# EasyEDA schematic SCH_FMC-R2_MTOP_2026-02-22.json

## Sheets
1 MAIN: TITLE: MAIN - Devboard 1; REV: 1.0; Date: 2026-02-08; Sheet: 1/1; Drawn By: Lloyd Cargo; Company: UNR
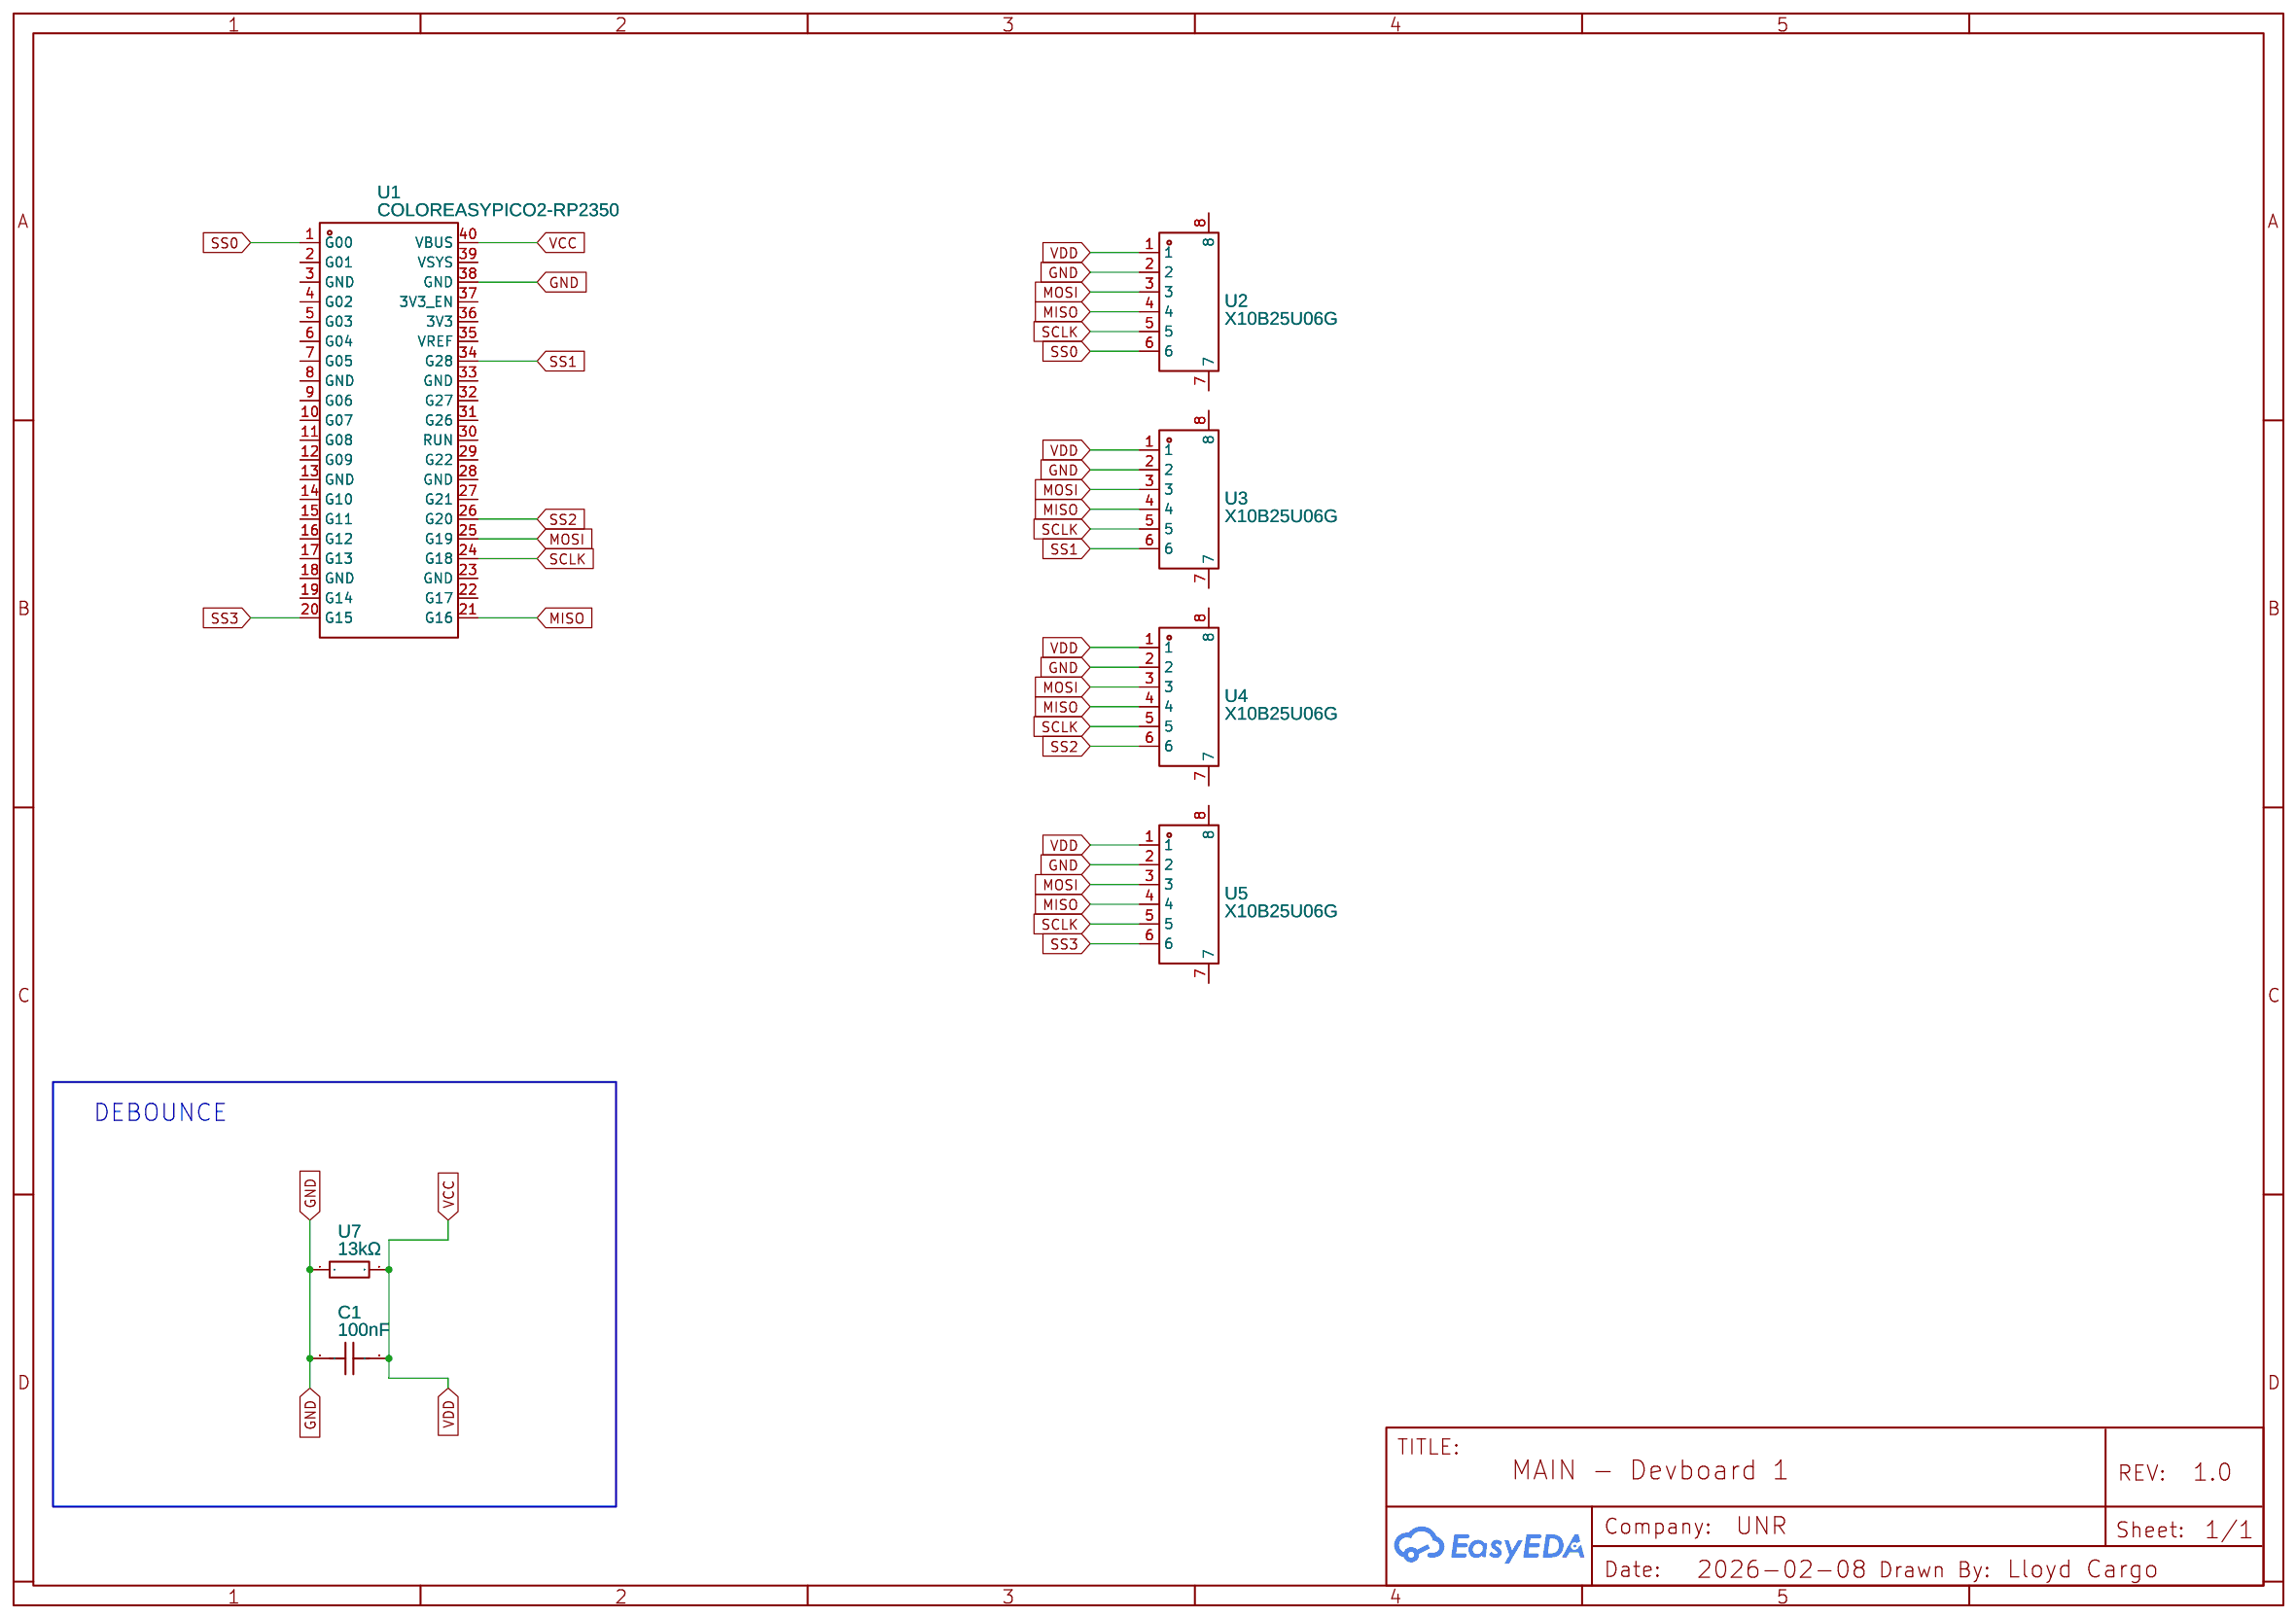
[diagram p0: MAIN]
2 module top: TITLE: module top
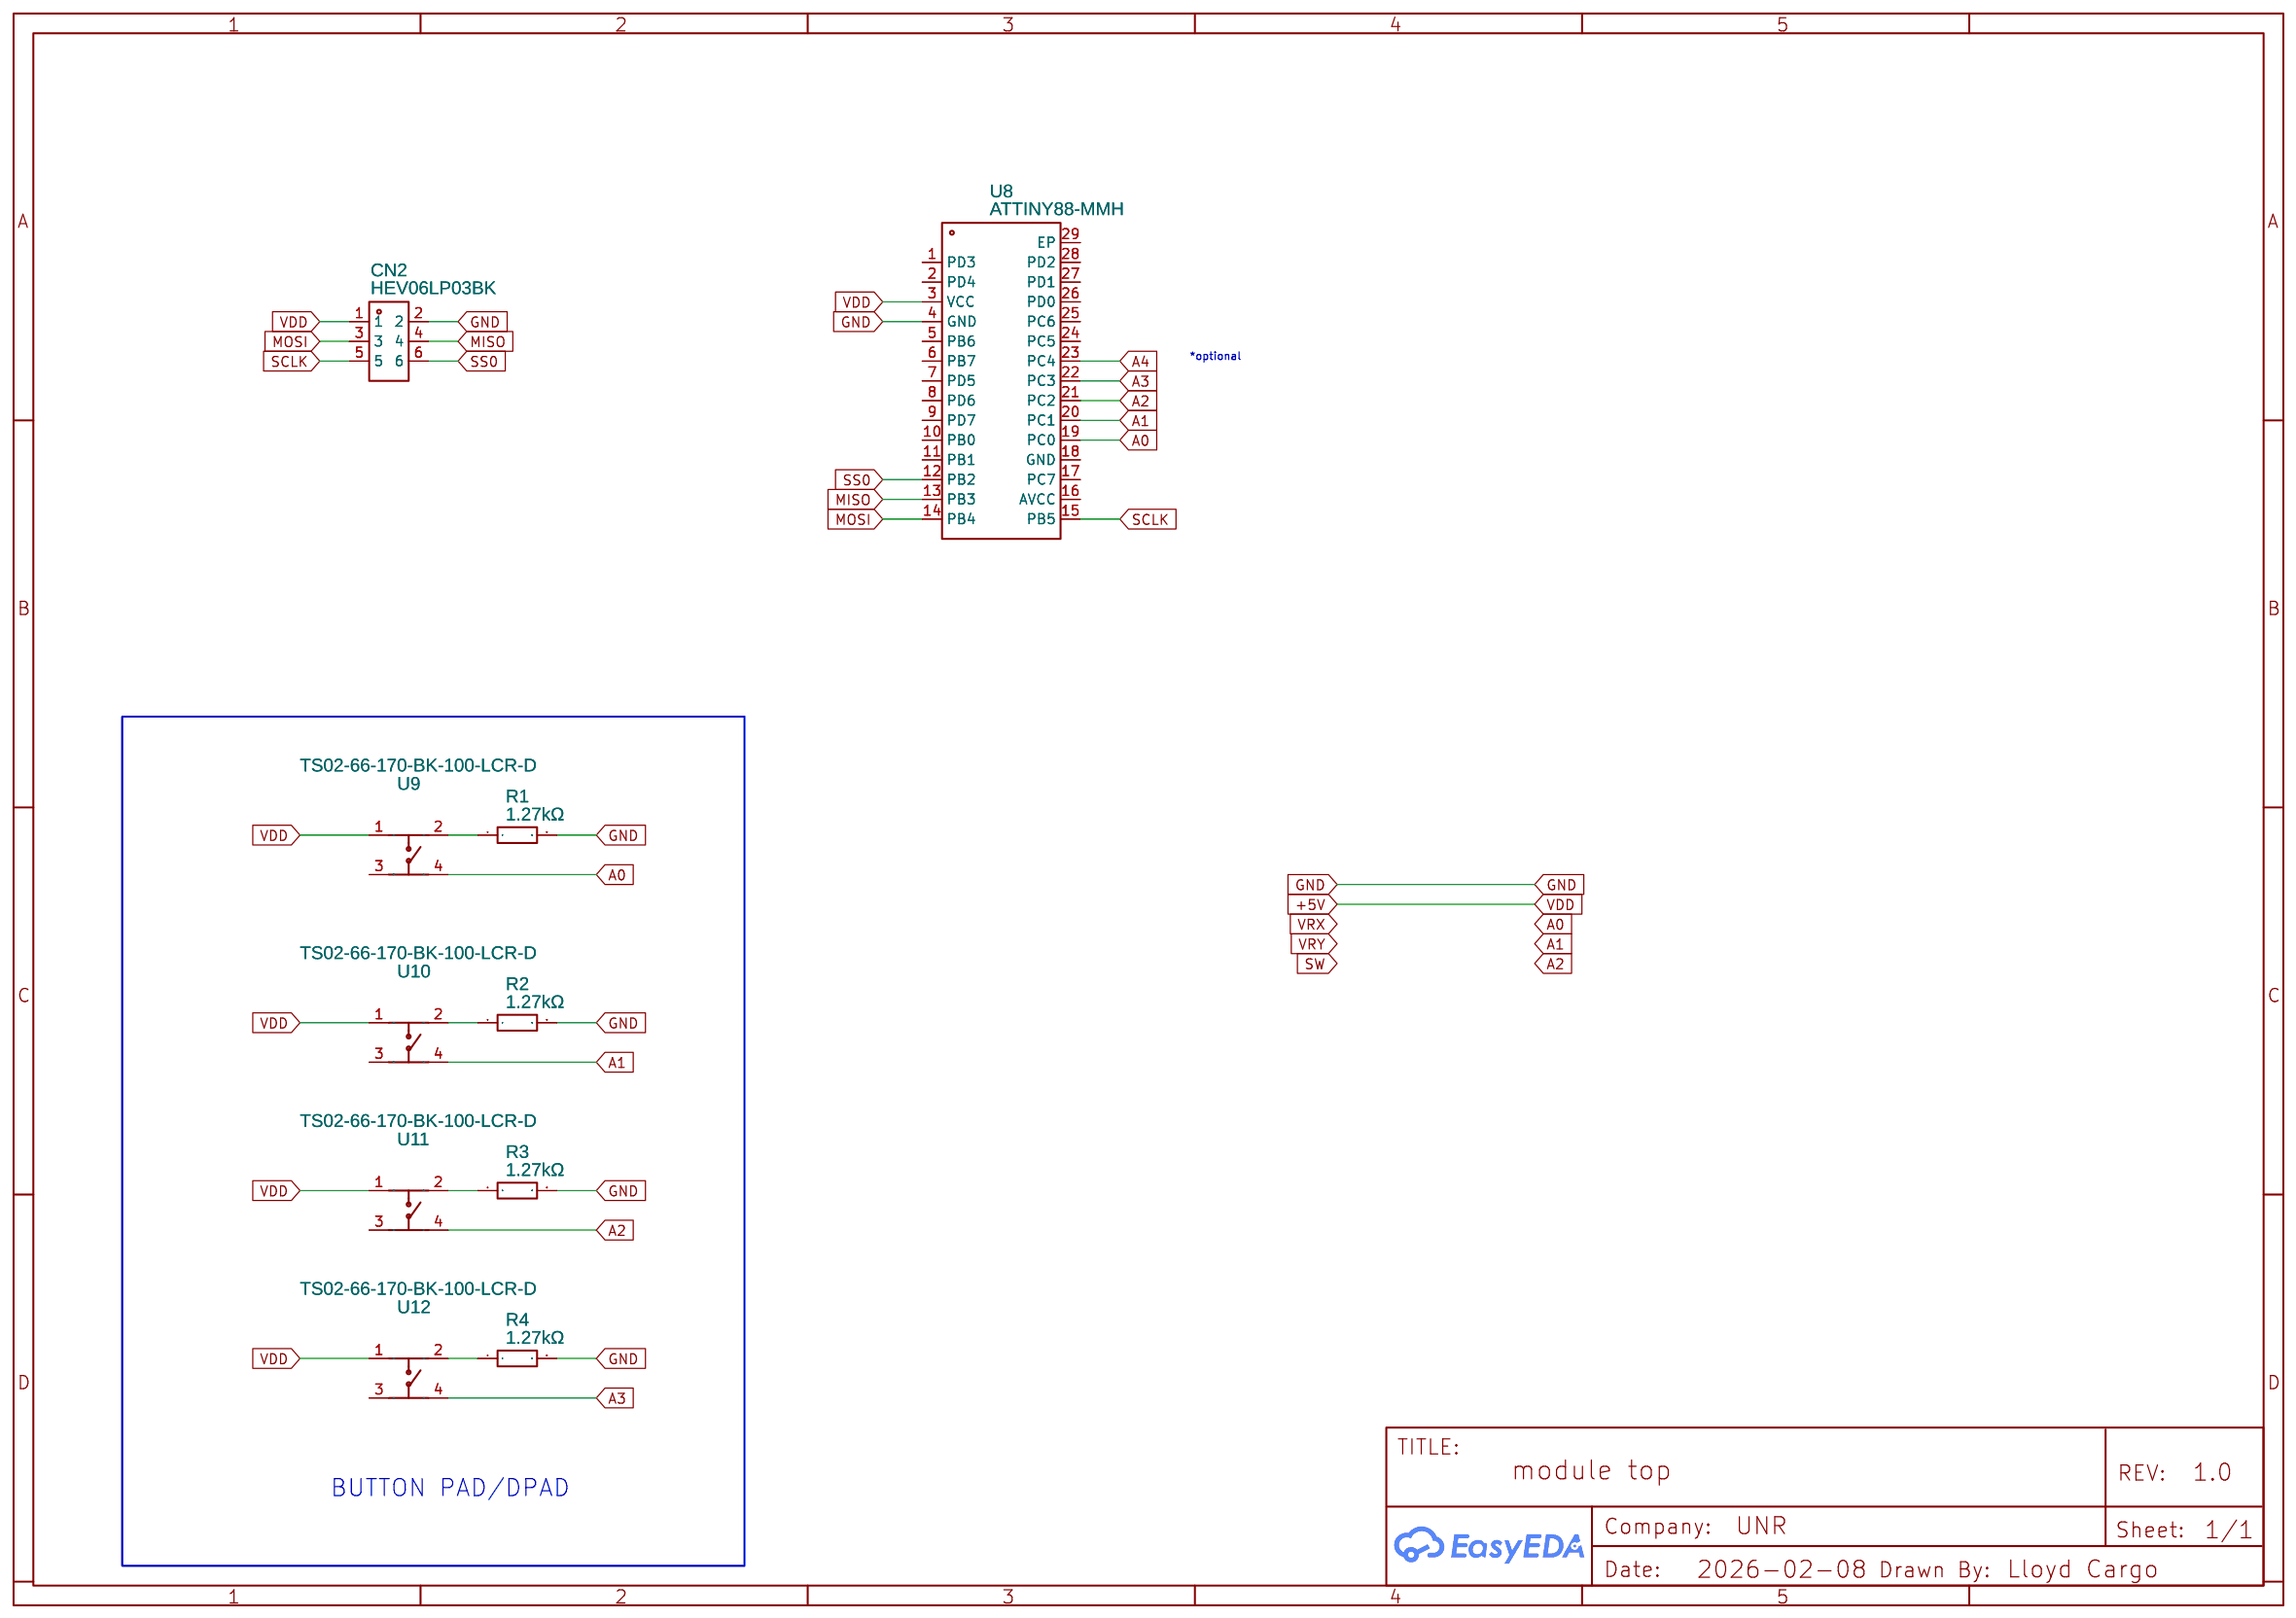
[diagram p1: module top]
3 module baseboard: TITLE: module baseboard; Company: Your Company
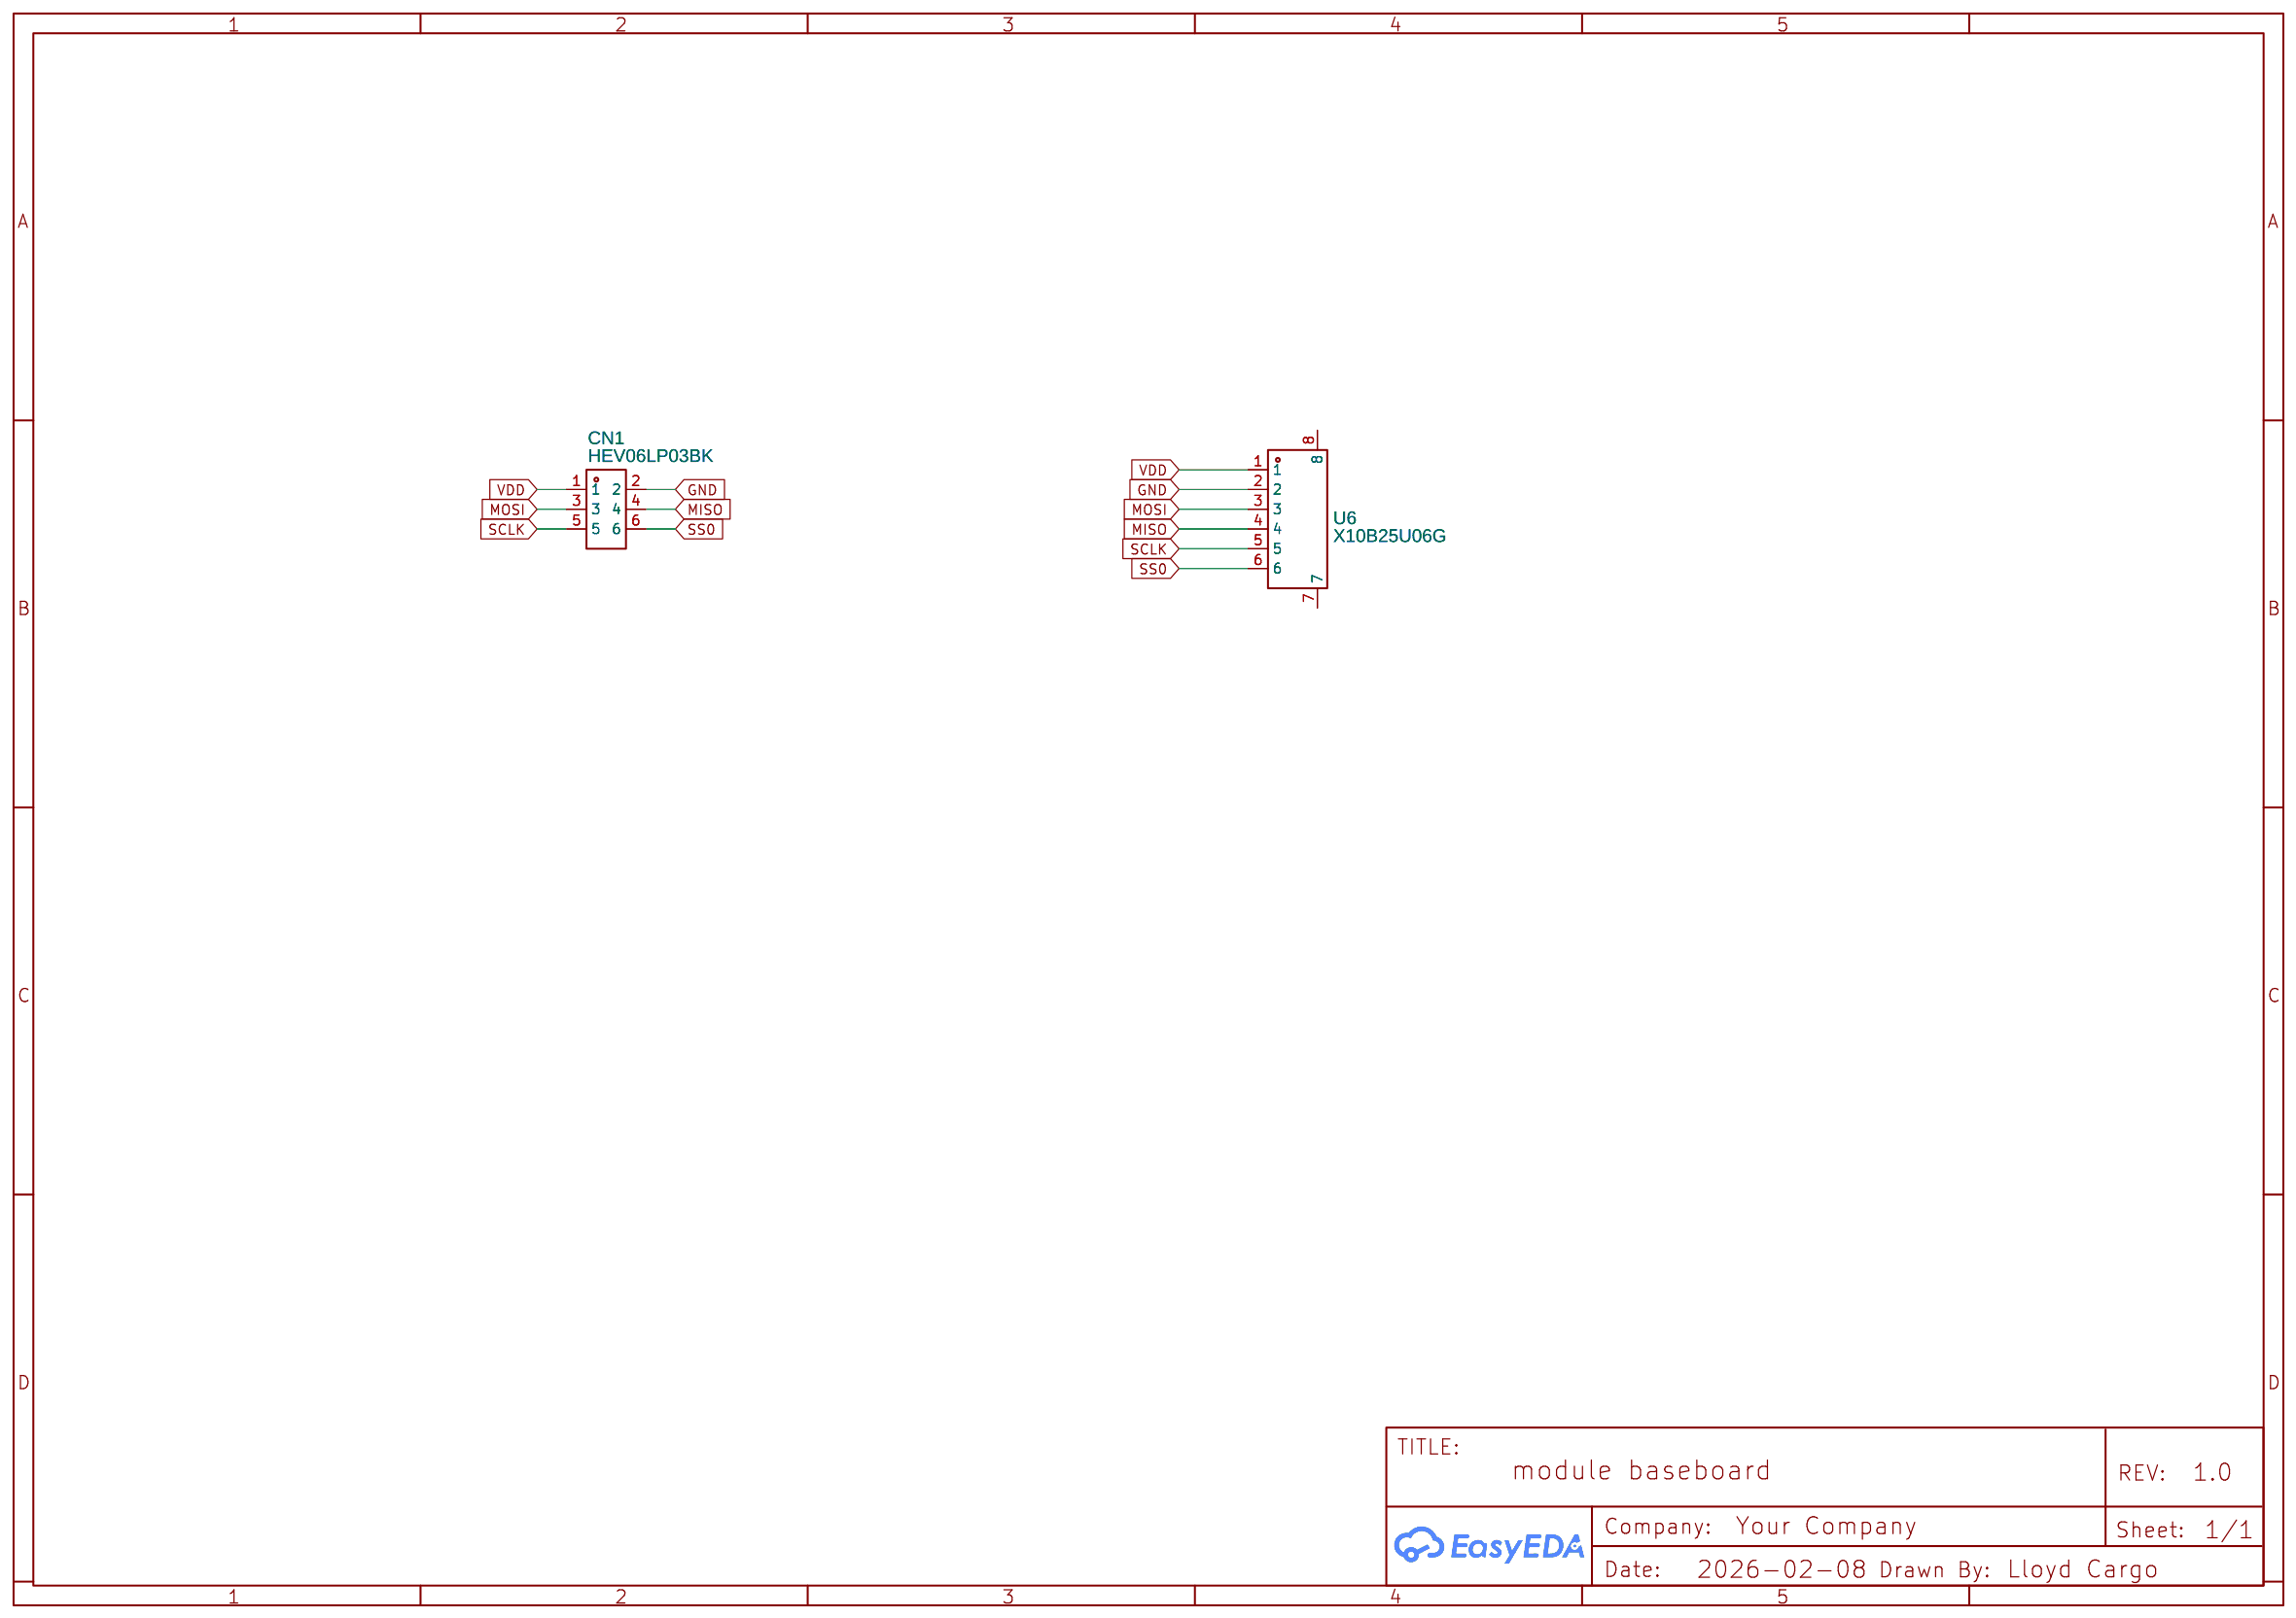
[diagram p2: module baseboard]

## Parts
sheet MAIN
C1  100nF  [C0603]
U1  COLOREASYPICO2-RP2350  [COMM-TH_COLOREASYPICO2-RP2350]
U2  X10B25U06G  [FPC-SMD_6P-P1.00_XKB_X10B25U06G]
U3  X10B25U06G  [FPC-SMD_6P-P1.00_XKB_X10B25U06G]
U4  X10B25U06G  [FPC-SMD_6P-P1.00_XKB_X10B25U06G]
U5  X10B25U06G  [FPC-SMD_6P-P1.00_XKB_X10B25U06G]
U7  13kΩ  [R0805]
sheet module baseboard
CN1  HEV06LP03BK  [CONN-SMD_HEV06LP03BK]
U6  X10B25U06G  [FPC-SMD_6P-P1.00_XKB_X10B25U06G]
sheet module top
CN2  HEV06LP03BK  [CONN-SMD_HEV06LP03BK]
R1  1.27kΩ  [R0603]
R2  1.27kΩ  [R0603]
R3  1.27kΩ  [R0603]
R4  1.27kΩ  [R0603]
U8  ATTINY88-MMH  [VQFN-28_L4.0-W4.0-P0.45-TL-EP2.4]
U9  TS02-66-170-BK-100-LCR-D  [SW-TH_4P-L6.0-W6.0-P4.50-LS6.5]
U10  TS02-66-170-BK-100-LCR-D  [SW-TH_4P-L6.0-W6.0-P4.50-LS6.5]
U11  TS02-66-170-BK-100-LCR-D  [SW-TH_4P-L6.0-W6.0-P4.50-LS6.5]
U12  TS02-66-170-BK-100-LCR-D  [SW-TH_4P-L6.0-W6.0-P4.50-LS6.5]

## Library data of the parts
C1 = GCG188R92A104KA03D: Supplier: LCSC; Supplier Part: C2179328; Manufacturer: muRata(村田); Contributor: lcsc
U1 = COLOREASYPICO2-RP2350: Supplier: LCSC; Supplier Part: C42924268; Manufacturer: 立创开发板; Manufacturer Part: ColorEasyPico2-RP2350; Contributor: lcsc; JLCPCB Part Class: Extended Part
U2-U6 = X10B25U06G: Contributor: LCSC; Supplier: LCSC; Supplier Part: C2881212; Manufacturer: XKB Connection(中国星坤); JLCPCB Part Class: Extended Part
U7 = HPCR0805F13K0K9: Contributor: LCSC; Supplier: LCSC; Supplier Part: C365241; Manufacturer: RESI(开步睿思); JLCPCB Part Class: Extended Part
CN1 CN2 = HEV06LP03BK: Supplier: LCSC; Supplier Part: C5448252; Manufacturer: WingTAT(格林柏); JLCPCB Part Class: Extended Part; Contributor: lcsc
R1-R4 = RC0603FR-071K27L: Contributor: LCSC; Supplier: LCSC; Supplier Part: C245930; Manufacturer: YAGEO(国巨); JLCPCB Part Class: Extended Part
U8 = ATTINY88-MMH: Contributor: LCSC; Supplier: LCSC; Supplier Part: C1340979; Manufacturer: MICROCHIP(美国微芯); JLCPCB Part Class: Extended Part
U9-U12 = TS02-66-170-BK-100-LCR-D: Contributor: lcsc; Supplier: LCSC; Supplier Part: C4364922; Manufacturer: CUI; JLCPCB Part Class: Extended Part

## Nets
+5V: C1.2 CN1.1 CN2.1 U1.40(VBUS) U2.1 U3.1 U4.1 U5.1 U6.1 U7.2 U8.3(VCC) U9.1 U10.1 U11.1 U12.1
GND: C1.1 CN1.2 CN2.2 R1.2 R2.2 R3.2 R4.2 U1.38(GND) U2.2 U3.2 U4.2 U5.2 U6.2 U7.1 U8.4(GND)
A0: U8.19(PC0) U9.4
A1: U8.20(PC1) U10.4
A2: U8.21(PC2) U11.4
A3: U8.22(PC3) U12.4
A4: U8.23(PC4)
MISO: CN1.4 CN2.4 U1.21(G16) U2.4 U3.4 U4.4 U5.4 U6.4 U8.13(PB3)
MOSI: CN1.3 CN2.3 U1.25(G19) U2.3 U3.3 U4.3 U5.3 U6.3 U8.14(PB4)
SCLK: CN1.5 CN2.5 U1.24(G18) U2.5 U3.5 U4.5 U5.5 U6.5 U8.15(PB5)
SS0: CN1.6 CN2.6 U1.1(G00) U2.6 U6.6 U8.12(PB2)
SS1: U1.34(G28) U3.6
SS2: U1.26(G20) U4.6
SS3: U1.20(G15) U5.6
Net-(R1-1): R1.1 U9.2
Net-(R2-1): R2.1 U10.2
Net-(R3-1): R3.1 U11.2
Net-(R4-1): R4.1 U12.2

Not connected (* = marked no-connect by the designer): U1 2(G01) 3(GND) 4(G02) 5(G03) 6(G04) 7(G05) 8(GND) 9(G06) 10(G07) 11(G08) 12(G09) 13(GND) 14(G10) 15(G11) 16(G12) 17(G13) 18(GND) 19(G14) 22(G17) 23(GND) 27(G21) 28(GND) 29(G22) 30(RUN) 31(G26) 32(G27) 33(GND) 35(VREF) 36(3V3) 37(3V3_EN) 39(VSYS); U2 7 8; U3 7 8; U4 7 8; U5 7 8; U6 7 8; U8 1(PD3) 2(PD4) 5(PB6) 6(PB7) 7(PD5) 8(PD6) 9(PD7) 10(PB0) 11(PB1) 16(AVCC) 17(PC7) 18(GND) 24(PC5) 25(PC6) 26(PD0) 27(PD1) 28(PD2) 29(EP); U9 3; U10 3; U11 3; U12 3

## Notes on the sheets
sheet 1
- DEBOUNCE
sheet 2
- *optional
- BUTTON PAD/DPAD
